# Altium schematic sheet HYDRA_V4_ACTUATOR.SchDoc
size C; SheetNumber: 1; SheetTotal: 5
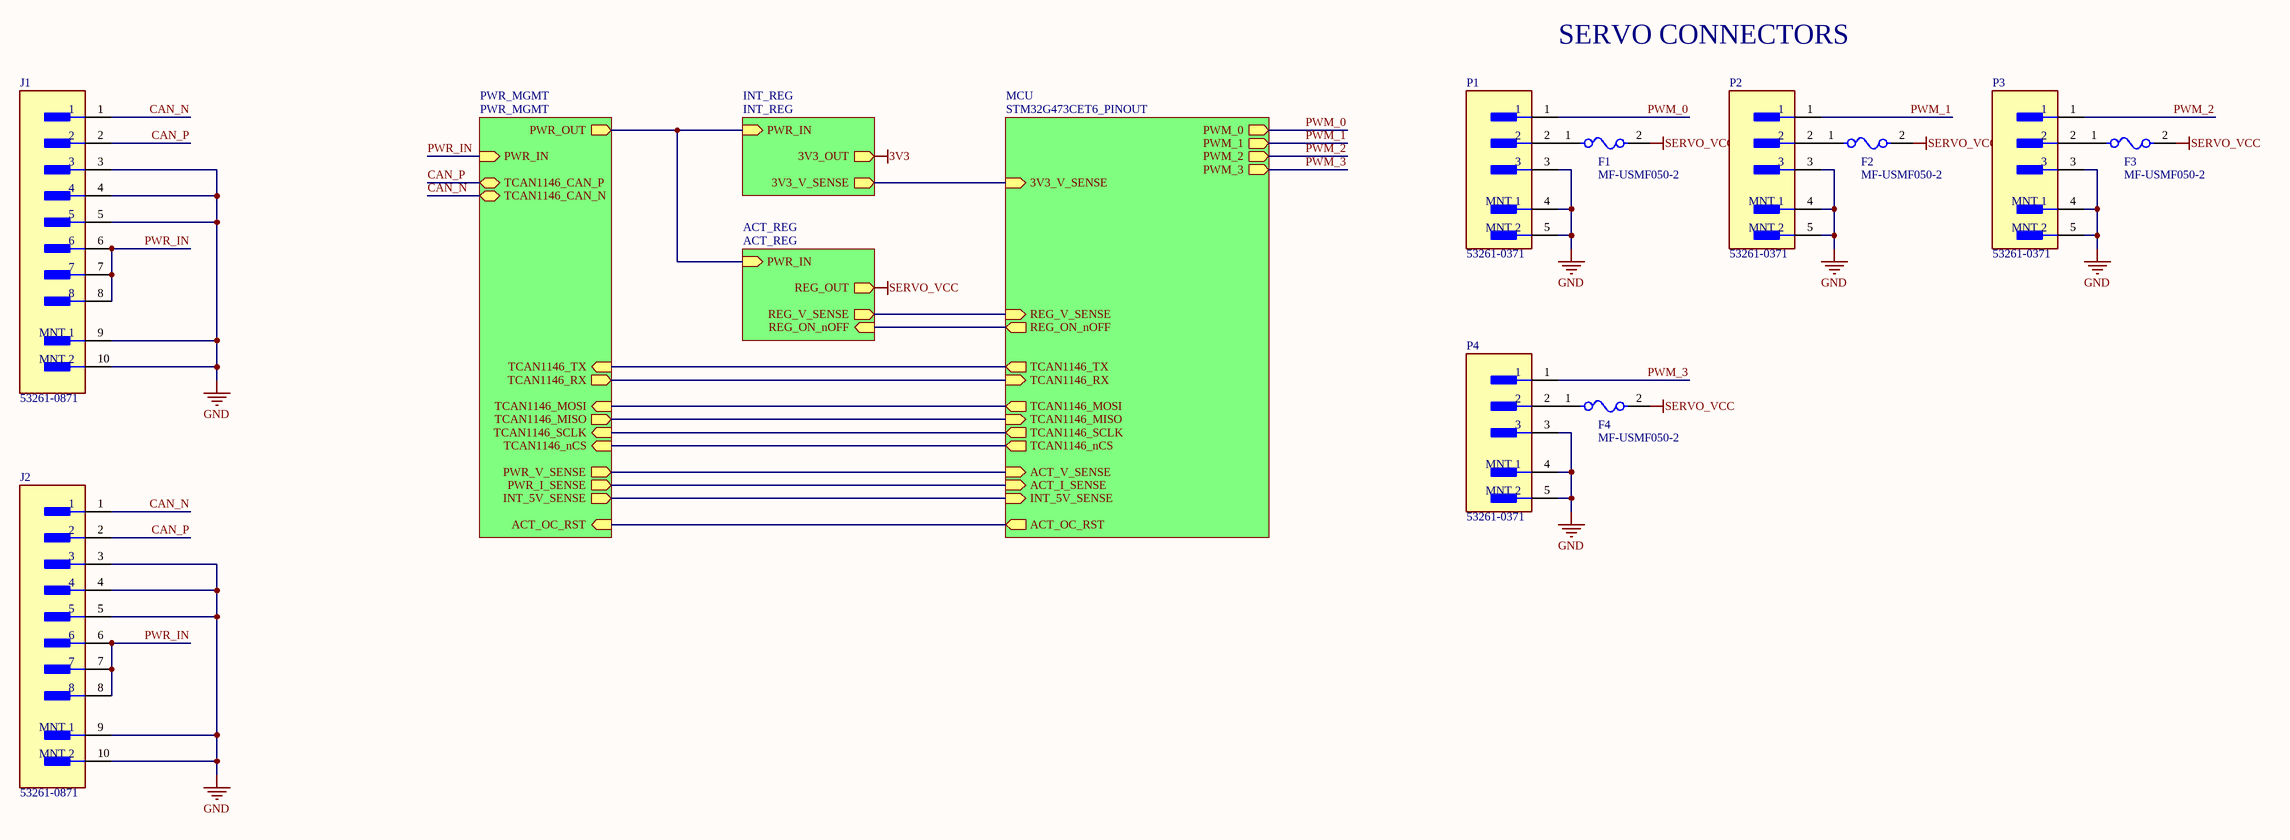
[diagram p0: HYDRA_V4_ACTUATOR.SchDoc]

## Parts
F1  MF-USMF050-2  [FP-MF-USMF-MFG]
F2  MF-USMF050-2  [FP-MF-USMF-MFG]
F3  MF-USMF050-2  [FP-MF-USMF-MFG]
F4  MF-USMF050-2  [FP-MF-USMF-MFG]
J1  53261-0871  [FP-532610871-MFG]
J2  53261-0871  [FP-532610871-MFG]
P1  53261-0371  [FP-53261-0371-MFG]
P2  53261-0371  [FP-53261-0371-MFG]
P3  53261-0371  [FP-53261-0371-MFG]
P4  53261-0371  [FP-53261-0371-MFG]

## Sub-sheets
ACT_REG = ACT_REG: PWR_IN (in), REG_OUT (out), REG_V_SENSE (out), REG_ON_nOFF (in)
INT_REG = INT_REG: PWR_IN (in), 3V3_OUT (out), 3V3_V_SENSE (out)
MCU = STM32G473CET6_PINOUT: 3V3_V_SENSE (in), REG_V_SENSE (in), ACT_OC_RST (out), INT_5V_SENSE (in), ACT_I_SENSE (in), ACT_V_SENSE (in), TCAN1146_nCS (out), TCAN1146_SCLK (out), TCAN1146_MISO (in), TCAN1146_MOSI (out), TCAN1146_TX (out), TCAN1146_RX (in), PWM_0 (out), PWM_1 (out), PWM_3 (out), PWM_2 (out), REG_ON_nOFF (out)
PWR_MGMT = PWR_MGMT: PWR_IN (in), PWR_OUT (out), TCAN1146_TX (in), TCAN1146_RX (out), TCAN1146_MOSI (in), TCAN1146_MISO (out), TCAN1146_SCLK (in), TCAN1146_nCS (in), PWR_I_SENSE (out), PWR_V_SENSE (out), INT_5V_SENSE (out), ACT_OC_RST (in), TCAN1146_CAN_P (bidir), TCAN1146_CAN_N (bidir)

## Nets
3V3: sheet INT_REG/3V3_OUT
GND: J1.3 J1.4 J1.5 J1.9(MNT_1) J1.10(MNT_2) J2.3 J2.4 J2.5 J2.9(MNT_1) J2.10(MNT_2) P1.3 P1.4(MNT_1) P1.5(MNT_2) P2.3 P2.4(MNT_1) P2.5(MNT_2) P3.3 P3.4(MNT_1) P3.5(MNT_2) P4.3 P4.4(MNT_1) P4.5(MNT_2)
SERVO_VCC: F1.2 F2.2 F3.2 F4.2 ; sheet ACT_REG/REG_OUT
CAN_N: J1.1 J2.1 ; sheet PWR_MGMT/TCAN1146_CAN_N
CAN_P: J1.2 J2.2 ; sheet PWR_MGMT/TCAN1146_CAN_P
PWM_0: P1.1 ; sheet MCU/PWM_0
PWM_1: P2.1 ; sheet MCU/PWM_1
PWM_2: P3.1 ; sheet MCU/PWM_2
PWM_3: P4.1 ; sheet MCU/PWM_3
PWR_IN: J1.6 J1.7 J1.8 J2.6 J2.7 J2.8 ; sheet PWR_MGMT/PWR_IN
NetF1_1: F1.1 P1.2
NetF2_1: F2.1 P2.2
NetF3_1: F3.1 P3.2
NetF4_1: F4.1 P4.2
(unnamed): sheet PWR_MGMT/PWR_OUT, sheet INT_REG/PWR_IN, sheet ACT_REG/PWR_IN
(unnamed): sheet PWR_MGMT/TCAN1146_TX, sheet MCU/TCAN1146_TX
(unnamed): sheet PWR_MGMT/TCAN1146_RX, sheet MCU/TCAN1146_RX
(unnamed): sheet PWR_MGMT/TCAN1146_MOSI, sheet MCU/TCAN1146_MOSI
(unnamed): sheet PWR_MGMT/TCAN1146_MISO, sheet MCU/TCAN1146_MISO
(unnamed): sheet PWR_MGMT/TCAN1146_SCLK, sheet MCU/TCAN1146_SCLK
(unnamed): sheet PWR_MGMT/TCAN1146_nCS, sheet MCU/TCAN1146_nCS
(unnamed): sheet PWR_MGMT/PWR_I_SENSE, sheet MCU/ACT_I_SENSE
(unnamed): sheet PWR_MGMT/PWR_V_SENSE, sheet MCU/ACT_V_SENSE
(unnamed): sheet PWR_MGMT/INT_5V_SENSE, sheet MCU/INT_5V_SENSE
(unnamed): sheet PWR_MGMT/ACT_OC_RST, sheet MCU/ACT_OC_RST
(unnamed): sheet INT_REG/3V3_V_SENSE, sheet MCU/3V3_V_SENSE
(unnamed): sheet MCU/REG_V_SENSE, sheet ACT_REG/REG_V_SENSE
(unnamed): sheet MCU/REG_ON_nOFF, sheet ACT_REG/REG_ON_nOFF

## Notes on the sheet
- SERVO CONNECTORS

## Library data of the parts
F1-F4 = CMP-07400-000020-1: PTC RESET FUSE 13.2V 500MA 1210; Manufacturer: Bourns Inc.; Value: 0.18-0.9Ω; Trip Current: 1A; Current Rating: 40A; Trip Time: 0.1s; Automotive Grade: Grade 3; Hold Current: 0.5A; Package: MF-USMF; Voltage Rating: 13.2V; Device Class L2: PTC Resettable Fuses; Temperature: -40°C to +85°C; Device Class L1: Circuit Protection; Device Class L3: unset; Height: 0.85mm; ComponentLink2Description: Datasheet; Temperature Range Low: -40°C; Ambient Temperature Range Low: -40°C; Category: Fuse; Lead Free: Yes; Temperature Range High: +85°C; Mouser Description: Resettable Fuses - PPTC 0.50A 13.2V 0.18ohm Hold .5A Trip 1A; Manufacturer Part Number: MF-USMF050-2; Resistance: 0.18-0.9Ω; RoHS: TRUE; Ipc Land Pattern Name: CAPC321258X70; Ambient Temperature Range High: +85°C; Automotive: Yes; Digikey Description: PTC RESET FUSE 13.2V 500MA 1210; Octopart: https://octopart.com/mf-usmf050-2-bourns-97645; ComponentLink2URL: https://www.bourns.com/docs/Product-Datasheets/mfusmf.pdf
J1 J2 = CMP-002-00053-1: Board Connector, 8 Contact(s), 1 Row(s), Male, Right Angle, 0.049 inch Pitch, Surface Mount Terminal, Locking, Natural Insulator, Receptacle; RoHS Compliant: Yes; Max Operating Temperature: 85°C; Min Operating Temperature: -40°C; Connector Type: BOARD CONNECTOR; Mounting Technology: Board
P1-P4 = CMP-04776-000071-1: CONN HEADER SMD R/A 3POS 1.25MM; Manufacturer: Molex; Number Of Contacts: 3; Conn Orientation: Right Angle; Current Rating: 1A; Voltage Rating: 125V; Conn Gender: Male; Category: Conn; Automotive: No; Footprint Url: https://www.molex.com/pdm_docs/sd/532610371_sd.pdf; Height: 3.6mm; Number Of Rows: 1; Temperature Range Low: -40°C; Package: 0; Octopart: https://octopart.com/53261-0371-molex-655314; ComponentLink2Description: Datasheet; Lead Free: Yes; Ambient Temperature Range Low: -40°C; Device Class L3: unset; Mouser Description: 1.25mm (.049") Pitch PicoBlade Header, Surface Mount, Right Angle, Lead-free, 3 Circuits; Digikey Description: CONN HEADER SMD R/A 3POS 1.25MM; Device Class L2: Headers and Wire Housings; Contact Material: Tin,Nickel; Manufacturer Part Number: 53261-0371; Ambient Temperature Range High: +105°C; ComponentLink2URL: https://www.molex.com/webdocs/datasheets/pdf/en-us/0532610371_PCB_HEADERS.pdf; Pitch: 1.25mm; Temperature: -40°C to +105°C; RoHS: TRUE; Device Class L1: Connectors; Temperature Range High: +105°C